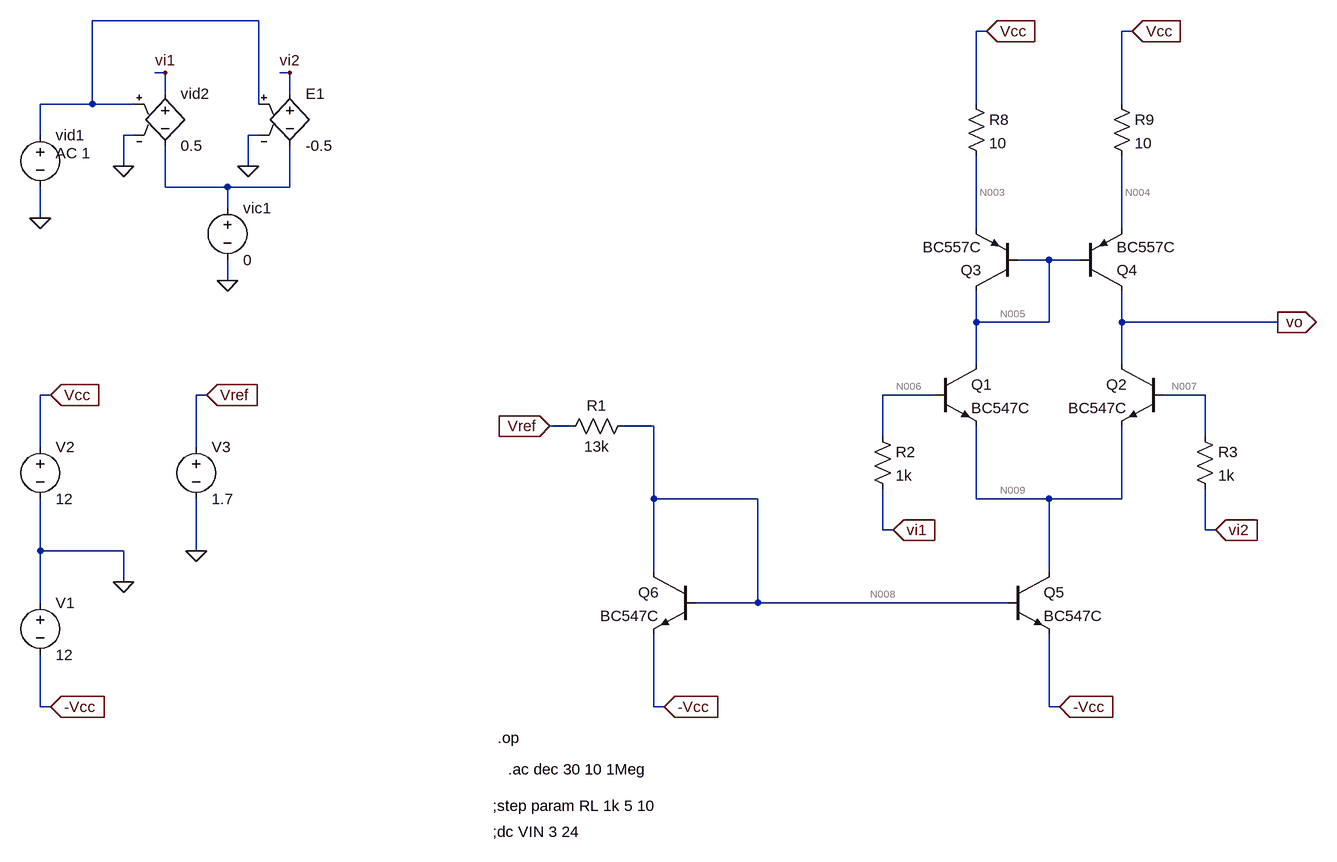
[diagram p0: schematic TBJ.asc]
TBJ.asc, the LTspice schematic file:
Version 4
SHEET 1 2316 992
WIRE -1008 -272 -1264 -272
WIRE 112 -256 96 -256
WIRE 336 -256 320 -256
WIRE -1152 -192 -1168 -192
WIRE -960 -192 -976 -192
WIRE -1152 -160 -1152 -192
WIRE -960 -160 -960 -192
WIRE -1264 -144 -1264 -272
WIRE -1264 -144 -1344 -144
WIRE -1200 -144 -1264 -144
WIRE -1008 -144 -1008 -272
WIRE 96 -144 96 -256
WIRE 320 -144 320 -256
WIRE -1344 -96 -1344 -144
WIRE -1200 -96 -1216 -96
WIRE -1008 -96 -1024 -96
WIRE -1216 -48 -1216 -96
WIRE -1024 -48 -1024 -96
WIRE -1152 -16 -1152 -80
WIRE -1056 -16 -1152 -16
WIRE -960 -16 -960 -80
WIRE -960 -16 -1056 -16
WIRE -1056 16 -1056 -16
WIRE -1344 32 -1344 -16
WIRE 96 48 96 -64
WIRE 320 48 320 -64
WIRE 208 96 160 96
WIRE 256 96 208 96
WIRE -1056 128 -1056 96
WIRE 96 192 96 144
WIRE 208 192 208 96
WIRE 208 192 96 192
WIRE 320 192 320 144
WIRE 560 192 320 192
WIRE 96 256 96 192
WIRE 320 256 320 192
WIRE -1328 304 -1344 304
WIRE -1088 304 -1104 304
WIRE 32 304 -48 304
WIRE 448 304 384 304
WIRE -528 352 -560 352
WIRE -400 352 -448 352
WIRE -48 368 -48 304
WIRE 448 368 448 304
WIRE -1344 384 -1344 304
WIRE -1104 384 -1104 304
WIRE -400 464 -400 352
WIRE -240 464 -400 464
WIRE 96 464 96 352
WIRE 208 464 96 464
WIRE 320 464 320 352
WIRE 320 464 208 464
WIRE -48 512 -48 448
WIRE -32 512 -48 512
WIRE 448 512 448 448
WIRE 464 512 448 512
WIRE -1344 544 -1344 464
WIRE -1216 544 -1344 544
WIRE -1104 544 -1104 464
WIRE -400 576 -400 464
WIRE 208 576 208 464
WIRE -1216 592 -1216 544
WIRE -1344 624 -1344 544
WIRE -240 624 -240 464
WIRE -240 624 -336 624
WIRE 144 624 -240 624
WIRE -1344 784 -1344 704
WIRE -1328 784 -1344 784
WIRE -400 784 -400 672
WIRE -384 784 -400 784
WIRE 208 784 208 672
WIRE 224 784 208 784
FLAG -560 352 Vref
IOPIN -560 352 In
FLAG 112 -256 Vcc
IOPIN 112 -256 In
FLAG 336 -256 Vcc
IOPIN 336 -256 In
FLAG -1056 128 0
FLAG -1152 -192 vi1
FLAG -960 -192 vi2
FLAG -1344 32 0
FLAG -1216 -48 0
FLAG -1024 -48 0
FLAG -32 512 vi1
IOPIN -32 512 In
FLAG 464 512 vi2
IOPIN 464 512 In
FLAG 560 192 vo
IOPIN 560 192 Out
FLAG -1328 304 Vcc
IOPIN -1328 304 In
FLAG -1104 544 0
FLAG -1088 304 Vref
IOPIN -1088 304 In
FLAG -1328 784 -Vcc
IOPIN -1328 784 In
FLAG -1216 592 0
FLAG -384 784 -Vcc
IOPIN -384 784 In
FLAG 224 784 -Vcc
IOPIN 224 784 In
DATAFLAG -400 352 ""
DATAFLAG -544 352 ""
DATAFLAG 96 -208 ""
DATAFLAG 320 -192 ""
DATAFLAG 96 0 ""
DATAFLAG 320 0 ""
DATAFLAG 512 192 ""
DATAFLAG 96 224 ""
DATAFLAG 416 192 ""
DATAFLAG 208 528 ""
SYMBOL pnp 160 144 R180
SYMATTR InstName Q3
SYMATTR Value BC557C
SYMBOL pnp 256 144 M180
SYMATTR InstName Q4
SYMATTR Value BC557C
SYMBOL npn 32 256 R0
SYMATTR InstName Q1
SYMATTR Value BC547C
SYMBOL npn 384 256 M0
SYMATTR InstName Q2
SYMATTR Value BC547C
SYMBOL res 80 -160 R0
SYMATTR InstName R8
SYMATTR Value 10
SYMBOL res 304 -160 R0
SYMATTR InstName R9
SYMATTR Value 10
SYMBOL npn 144 576 R0
SYMATTR InstName Q5
SYMATTR Value BC547C
SYMBOL npn -336 576 M0
SYMATTR InstName Q6
SYMATTR Value BC547C
SYMBOL res -432 336 R90
WINDOW 0 0 56 VBottom 2
WINDOW 3 32 56 VTop 2
SYMATTR InstName R1
SYMATTR Value 13k
SYMBOL voltage -1344 -112 R0
WINDOW 123 24 44 Left 2
WINDOW 39 0 0 Left 0
SYMATTR Value2 AC 1
SYMATTR InstName vid1
SYMATTR Value ""
SYMBOL e -1152 -176 R0
SYMATTR InstName vid2
SYMATTR Value 0.5
SYMBOL e -960 -176 R0
SYMATTR InstName E1
SYMATTR Value -0.5
SYMBOL voltage -1056 0 R0
SYMATTR InstName vic1
SYMATTR Value 0
SYMBOL res -64 352 R0
SYMATTR InstName R2
SYMATTR Value 1k
SYMBOL res 432 352 R0
SYMATTR InstName R3
SYMATTR Value 1k
SYMBOL voltage -1344 368 R0
WINDOW 123 0 0 Left 0
WINDOW 39 0 0 Left 0
SYMATTR InstName V2
SYMATTR Value 12
SYMBOL voltage -1104 368 R0
WINDOW 123 0 0 Left 0
WINDOW 39 0 0 Left 0
SYMATTR InstName V3
SYMATTR Value 1.7
SYMBOL voltage -1344 608 R0
WINDOW 123 0 0 Left 0
WINDOW 39 0 0 Left 0
SYMATTR InstName V1
SYMATTR Value 12
TEXT -640 832 Left 2 !.op
TEXT -648 976 Left 2 !;dc VIN 3 24
TEXT -648 936 Left 2 !;step param RL 1k 5 10
TEXT -624 880 Left 2 !.ac dec 30 10 1Meg

The netlist it stands for:
* TBJ.asc
Q3 N005 N005 N003 0 BC557C
Q4 vo N005 N004 0 BC557C
Q1 N005 N006 N009 0 BC547C
Q2 vo N007 N009 0 BC547C
R8 Vcc N003 10
R9 Vcc N004 10
Q5 N009 N008 -Vcc 0 BC547C
Q6 N008 N008 -Vcc 0 BC547C
R1 N008 Vref 13k
vid1 N001 0 AC 1
E§vid2 vi1 N002 N001 0 0.5
E1 vi2 N002 N001 0 -0.5
vic1 N002 0 0
R2 N006 vi1 1k
R3 N007 vi2 1k
V2 Vcc 0 12
V3 Vref 0 1.7
V1 0 -Vcc 12
.model NPN NPN
.model PNP PNP
.lib standard.bjt
.op
;dc VIN 3 24
;step param RL 1k 5 10
.ac dec 30 10 1Meg
.backanno
.end

* Results of the author's LTspice run, read from the files saved beside the schematic
* Operating Point, zero values left out:
*   V(n005) = 11.39 V
*   V(n003) = 11.99 V
*   V(vo) = 11.3 V
*   V(n004) = 11.99 V
*   V(n006) = -1.09 mV
*   V(n009) = -604.3 mV
*   V(n007) = -1.09 mV
*   V(vcc) = 12 V
*   V(n008) = -11.38 V
*   V(-vcc) = -12 V
*   V(vref) = 1.7 V
*   Ic(Q6) = 1.002 mA
*   Ib(Q6) = 2.214 µA
*   Ie(Q6) = -1.004 mA
*   Ic(Q5) = 1.205 mA
*   Ib(Q5) = 2.209 µA
*   Ie(Q5) = -1.207 mA
*   Ic(Q2) = 600.7 µA
*   Ib(Q2) = 1.09 µA
*   Ie(Q2) = -601.8 µA
*   Ic(Q1) = 601.6 µA
*   Ib(Q1) = 1.09 µA
*   Ie(Q1) = -602.7 µA
*   Ic(Q4) = -600.7 µA
*   Ib(Q4) = -1.346 µA
*   Ie(Q4) = 602.1 µA
*   Ic(Q3) = -598.9 µA
*   Ib(Q3) = -1.347 µA
*   Ie(Q3) = 600.2 µA
*   I(R3) = -1.09 µA
*   I(R2) = -1.09 µA
*   I(R1) = -1.006 mA
*   I(R9) = 602.1 µA
*   I(R8) = 600.2 µA
*   I(E1) = -1.09 µA
*   I(Vid2) = -1.09 µA
*   I(V1) = -2.211 mA
*   I(V3) = -1.006 mA
*   I(V2) = -1.202 mA
*   I(Vic1) = -2.181 µA
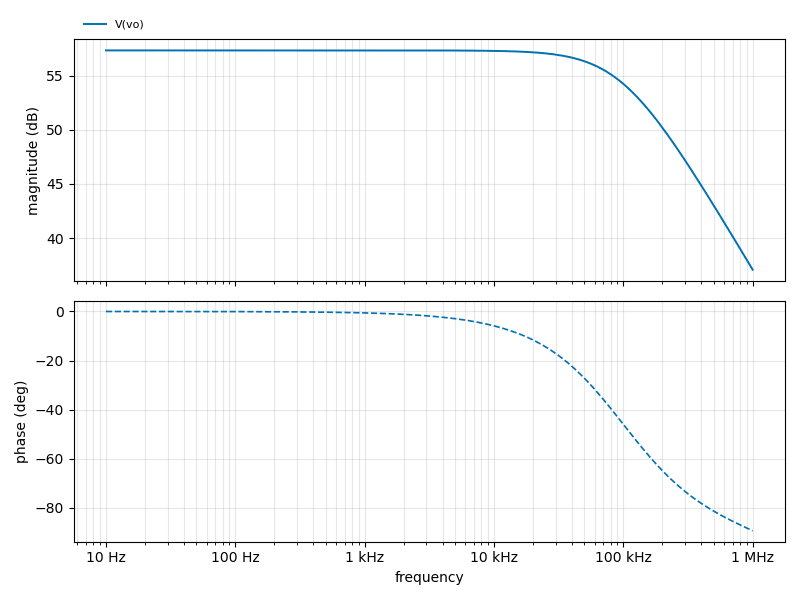
[diagram p1: AC Analysis of TBJ.asc, plotted from the saved traces]
* AC Analysis, 1 run:
*   V(vo): 57.32 dB at 10 Hz, 37.10 dB at 1 MHz, peak 57.32 dB at 10 Hz, 3 dB below the peak at 98.22 kHz
* From the log:
*   Semiconductor Device Operating Points:
*                           --- Bipolar Transistors ---
*   Name:       q6          q5          q2          q1          q4
*   Model:    bc547c      bc547c      bc547c      bc547c      bc557c
*   Ib:       2.21e-06    2.21e-06    1.09e-06    1.09e-06   -1.35e-06
*   Ic:       1.00e-03    1.20e-03    6.01e-04    6.02e-04   -6.01e-04
*   Vbe:      6.22e-01    6.22e-01    6.03e-01    6.03e-01   -6.05e-01
*   Vbc:      0.00e+00   -1.08e+01   -1.13e+01   -1.14e+01    9.05e-02
*   Vce:      6.22e-01    1.14e+01    1.19e+01    1.20e+01   -6.95e-01
*   BetaDC:   4.52e+02    5.45e+02    5.51e+02    5.52e+02    4.46e+02
*   Gm:       3.80e-02    4.58e-02    2.29e-02    2.29e-02    2.27e-02
*   Rpi:      1.18e+04    1.18e+04    2.40e+04    2.40e+04    1.97e+04
*   Rx:       1.00e+00    1.00e+00    1.00e+00    1.00e+00    1.00e+00
*   Ro:       5.25e+04    5.26e+04    1.06e+05    1.06e+05    3.96e+04
*   Cbe:      4.98e-11    5.34e-11    4.15e-11    4.15e-11    4.33e-11
*   Cbc:      2.74e-12    8.98e-13    8.86e-13    8.84e-13    4.60e-12
*   Cjs:      0.00e+00    0.00e+00    0.00e+00    0.00e+00    0.00e+00
*   BetaAC:   4.50e+02    5.42e+02    5.50e+02    5.51e+02    4.46e+02
*   Cbx:      1.69e-12    5.52e-13    5.45e-13    5.43e-13    2.71e-12
*   Ft:       1.12e+08    1.33e+08    8.49e+07    8.50e+07    7.15e+07
*   Name:       q3
*   Model:    bc557c
*   Ib:      -1.35e-06
*   Ic:      -5.99e-04
*   Vbe:     -6.05e-01
*   Vbc:      0.00e+00
*   Vce:     -6.05e-01
*   BetaDC:   4.45e+02
*   Gm:       2.26e-02
*   Rpi:      1.96e+04
*   Rx:       1.00e+00
*   Ro:       3.96e+04
*   Cbe:      4.32e-11
*   Cbc:      4.91e-12
*   Cjs:      0.00e+00
*   BetaAC:   4.45e+02
*   Cbx:      2.90e-12
*   Ft:       7.06e+07